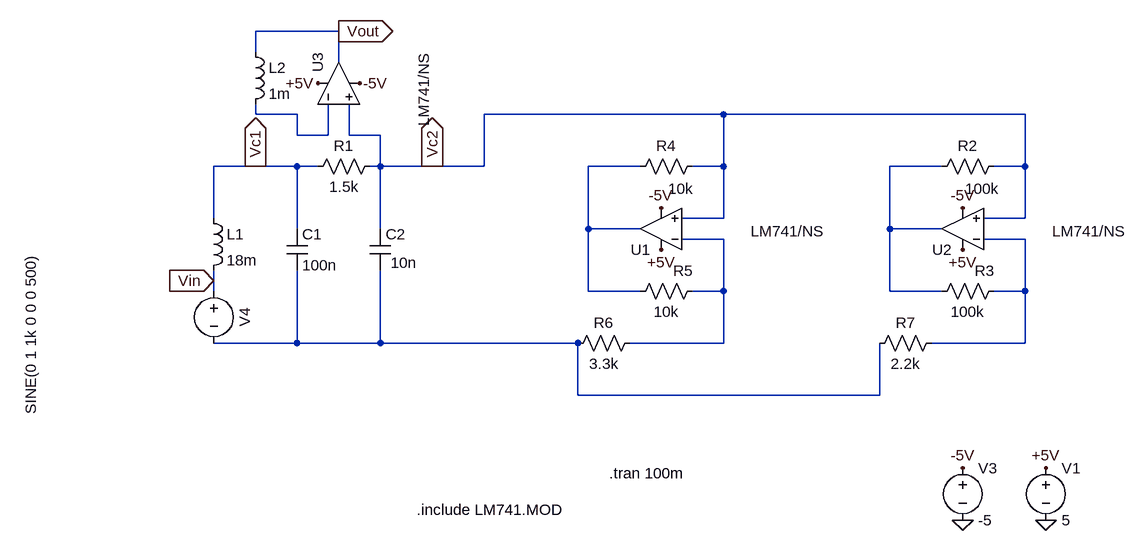
[diagram p0: schematic Draft1.asc]
Draft1.asc, the LTspice schematic file:
Version 4
SHEET 1 900 732
WIRE -848 -224 -976 -224
WIRE -976 -192 -976 -224
WIRE -848 -176 -848 -224
WIRE -976 -96 -976 -112
WIRE -912 -96 -976 -96
WIRE -256 -96 -624 -96
WIRE 208 -96 -256 -96
WIRE -912 -64 -912 -96
WIRE -864 -64 -864 -112
WIRE -864 -64 -912 -64
WIRE -832 -64 -832 -112
WIRE -784 -64 -832 -64
WIRE -976 -16 -1040 -16
WIRE -912 -16 -976 -16
WIRE -880 -16 -912 -16
WIRE -784 -16 -784 -64
WIRE -784 -16 -800 -16
WIRE -704 -16 -784 -16
WIRE -624 -16 -624 -96
WIRE -624 -16 -704 -16
WIRE -384 -16 -464 -16
WIRE -256 -16 -256 -96
WIRE -256 -16 -304 -16
WIRE 80 -16 0 -16
WIRE 208 -16 208 -96
WIRE 208 -16 160 -16
WIRE -1040 64 -1040 -16
WIRE -256 64 -256 -16
WIRE -256 64 -320 64
WIRE 208 64 208 -16
WIRE 208 64 144 64
WIRE -912 80 -912 -16
WIRE -784 80 -784 -16
WIRE -464 80 -464 -16
WIRE -384 80 -464 80
WIRE 0 80 0 -16
WIRE 80 80 0 80
WIRE -256 96 -320 96
WIRE 208 96 144 96
WIRE -1040 160 -1040 144
WIRE -1040 176 -1040 160
WIRE -464 176 -464 80
WIRE -384 176 -464 176
WIRE -256 176 -256 96
WIRE -256 176 -304 176
WIRE 0 176 0 80
WIRE 80 176 0 176
WIRE 208 176 208 96
WIRE 208 176 160 176
WIRE -912 256 -912 144
WIRE -912 256 -1040 256
WIRE -784 256 -784 144
WIRE -784 256 -912 256
WIRE -480 256 -784 256
WIRE -256 256 -256 176
WIRE -256 256 -400 256
WIRE 208 256 208 176
WIRE 208 256 64 256
WIRE -480 336 -480 256
WIRE -16 336 -16 256
WIRE -16 336 -480 336
FLAG 240 528 0
FLAG 240 448 +5V
FLAG -352 112 +5V
FLAG 112 528 0
FLAG 112 448 -5V
FLAG -352 48 -5V
FLAG -976 -16 Vc1
IOPIN -976 -16 Out
FLAG -704 -16 Vc2
IOPIN -704 -16 Out
FLAG 112 112 +5V
FLAG 112 48 -5V
FLAG -880 -144 +5V
FLAG -816 -144 -5V
FLAG -848 -224 Vout
IOPIN -848 -224 Out
FLAG -1040 160 Vin
IOPIN -1040 160 In
SYMBOL voltage 240 432 R0
WINDOW 123 0 0 Left 0
WINDOW 39 0 0 Left 0
SYMATTR InstName V1
SYMATTR Value 5
SYMBOL ind -1056 48 R0
SYMATTR InstName L1
SYMATTR Value 18m
SYMBOL cap -928 80 R0
SYMATTR InstName C1
SYMATTR Value 100n
SYMBOL cap -800 80 R0
WINDOW 3 32 52 Left 2
SYMATTR Value 10n
SYMATTR InstName C2
SYMBOL res -784 -32 R90
WINDOW 0 0 56 VBottom 2
WINDOW 3 32 56 VTop 2
SYMATTR InstName R1
SYMATTR Value 1.5k
SYMBOL res -400 0 R270
WINDOW 0 32 56 VTop 2
WINDOW 3 -3 78 VBottom 2
SYMATTR InstName R4
SYMATTR Value 10k
SYMBOL res -400 192 R270
WINDOW 0 32 82 VTop 2
WINDOW 3 0 56 VBottom 2
SYMATTR InstName R5
SYMATTR Value 10k
SYMBOL res -384 240 R90
WINDOW 0 0 56 VBottom 2
WINDOW 3 32 56 VTop 2
SYMATTR InstName R6
SYMATTR Value 3.3k
SYMBOL OpAmps\\opamp2 -352 144 R180
WINDOW 3 -252 60 Left 2
SYMATTR Value LM741/NS
SYMATTR InstName U1
SYMBOL voltage 112 432 R0
WINDOW 123 0 0 Left 0
WINDOW 39 0 0 Left 0
SYMATTR InstName V3
SYMATTR Value -5
SYMBOL res 64 0 R270
WINDOW 0 32 56 VTop 2
WINDOW 3 -3 78 VBottom 2
SYMATTR InstName R2
SYMATTR Value 100k
SYMBOL res 64 192 R270
WINDOW 0 32 82 VTop 2
WINDOW 3 0 56 VBottom 2
SYMATTR InstName R3
SYMATTR Value 100k
SYMBOL res 80 240 R90
WINDOW 0 0 56 VBottom 2
WINDOW 3 32 56 VTop 2
SYMATTR InstName R7
SYMATTR Value 2.2k
SYMBOL OpAmps\\opamp2 112 144 R180
WINDOW 3 -252 60 Left 2
SYMATTR Value LM741/NS
SYMATTR InstName U2
SYMBOL OpAmps\\opamp2 -912 -144 R270
WINDOW 3 -66 195 Left 2
SYMATTR Value LM741/NS
SYMATTR InstName U3
SYMBOL ind -992 -208 R0
SYMATTR InstName L2
SYMATTR Value 1m
SYMBOL voltage -1040 160 R0
WINDOW 0 32 56 VTop 2
WINDOW 3 -266 83 VBottom 2
WINDOW 123 0 0 Left 0
WINDOW 39 0 0 Left 0
SYMATTR InstName V4
SYMATTR Value SINE(0 1 1k 0 0 0 500)
TEXT -432 456 Left 2 !.tran 100m
TEXT -728 512 Left 2 !.include LM741.MOD

The netlist it stands for:
* Draft1.asc
V1 +5V 0 5
L1 Vc1 Vin 18m
C1 Vc1 N006 100n
C2 Vc2 N006 10n
R1 Vc2 Vc1 1.5k
R4 N002 Vc2 10k
R5 N002 N004 10k
R6 N004 N006 3.3k
XU1 Vc2 N004 +5V -5V N002 LM741/NS  ; pins In+ In- V+ V- OUT
V3 -5V 0 -5
R2 N003 Vc2 100k
R3 N003 N005 100k
R7 N005 N006 2.2k
XU2 Vc2 N005 +5V -5V N003 LM741/NS  ; pins In+ In- V+ V- OUT
XU3 Vc2 N001 +5V -5V Vout LM741/NS  ; pins In+ In- V+ V- OUT
L2 Vout N001 1m
V4 Vin N006 SINE(0 1 1k 0 0 0 500)
.tran 100m
.include LM741.MOD
.backanno
.end